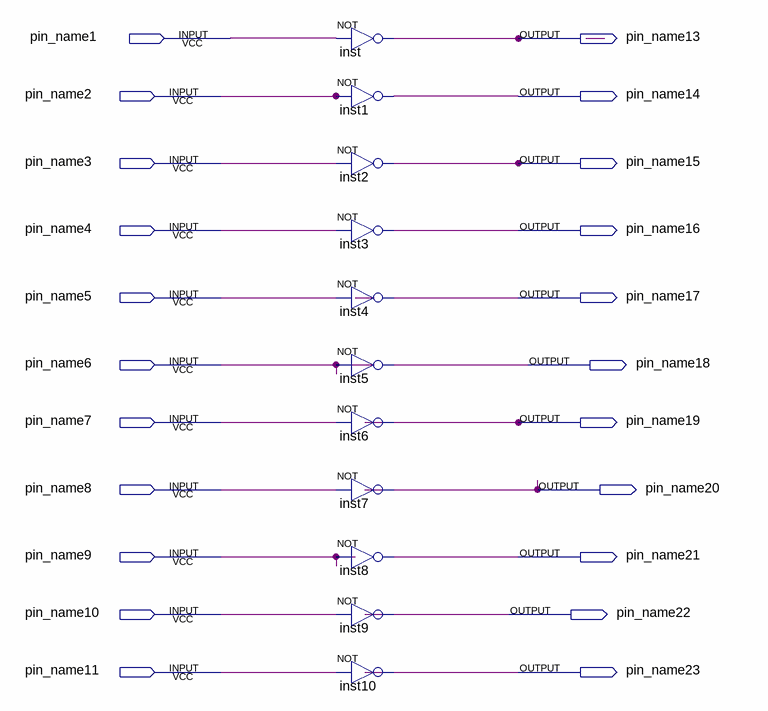
[diagram p0: schematic sheet]
// Quartus schematic lab1.bdf as structural Verilog: 11 symbols, 22 pins
module lab1 (
  input  pin_name1,
  input  pin_name2,
  input  pin_name3,
  input  pin_name4,
  input  pin_name5,
  input  pin_name6,
  input  pin_name7,
  input  pin_name8,
  input  pin_name9,
  input  pin_name10,
  input  pin_name11,
  output pin_name13,
  output pin_name14,
  output pin_name15,
  output pin_name16,
  output pin_name17,
  output pin_name18,
  output pin_name19,
  output pin_name20,
  output pin_name21,
  output pin_name22,
  output pin_name23
);

  not inst (pin_name13, pin_name1);
  not inst1 (pin_name14, pin_name2);
  not inst2 (pin_name15, pin_name3);
  not inst3 (pin_name16, pin_name4);
  not inst4 (pin_name17, pin_name5);
  not inst5 (pin_name18, pin_name6);
  not inst6 (pin_name19, pin_name7);
  not inst7 (pin_name20, pin_name8);
  not inst8 (pin_name21, pin_name9);
  not inst9 (pin_name22, pin_name10);
  not inst10 (pin_name23, pin_name11);
endmodule
